# EAGLE design ay-stereo (EAGLE 7.6.0)
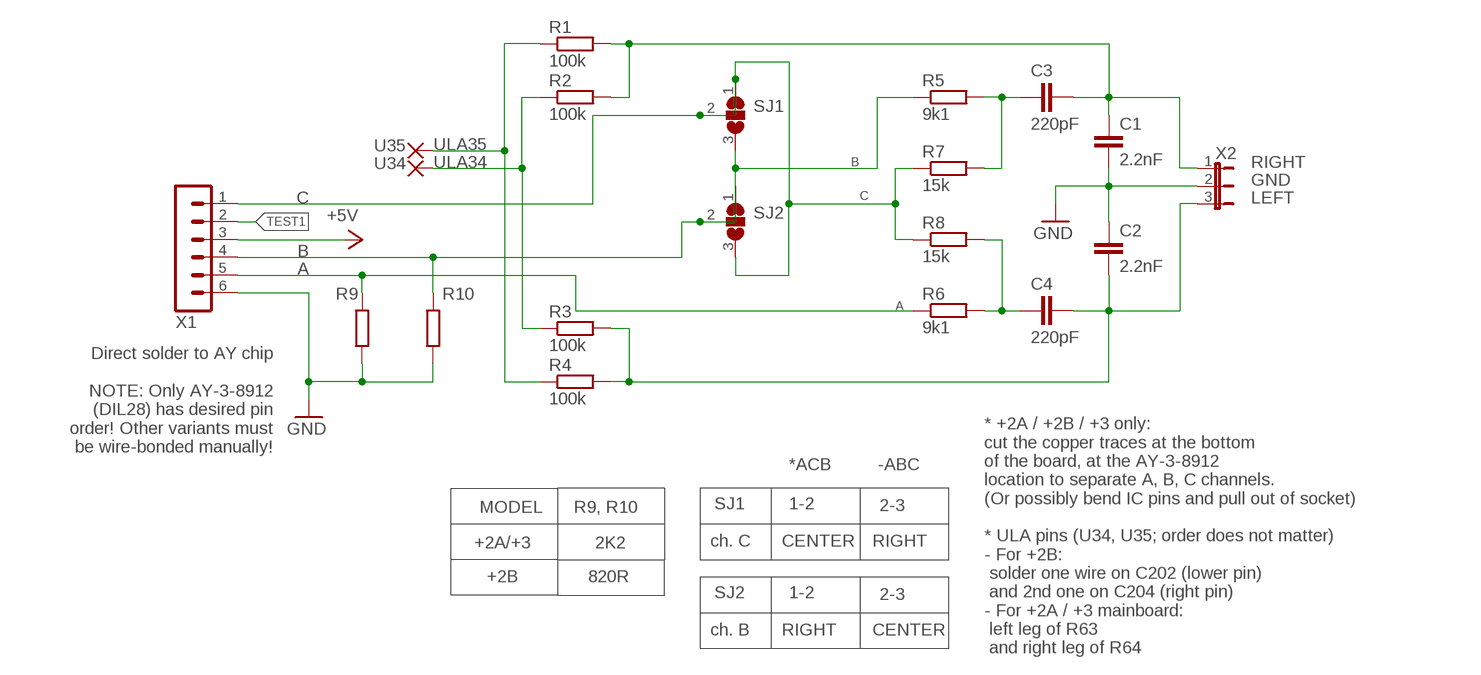
[diagram p0: schematic, sheet 1]

## Parts
C1  2.2nF  C-EUC0805  [C0805]
C2  2.2nF  C-EUC0805  [C0805]
C3  220pF  C-EUC0805  [C0805]
C4  220pF  C-EUC0805  [C0805]
R1  100k  R-EU_R0805  [R0805]
R2  100k  R-EU_R0805  [R0805]
R3  100k  R-EU_R0805  [R0805]
R4  100k  R-EU_R0805  [R0805]
R5  9k1  R-EU_R0805  [R0805]
R6  9k1  R-EU_R0805  [R0805]
R7  15k  R-EU_R0805  [R0805]
R8  15k  R-EU_R0805  [R0805]
R9  R-EU_R0805  [R0805]
R10  R-EU_R0805  [R0805]
SJ1  SJ2W  [SJ_2]
SJ2  SJ2W  [SJ_2]
U34  1,6/0,8  [1,6/0,8]
U35  1,6/0,8  [1,6/0,8]
X1  MA06-1  [MA06-1]
X2  JP2E  [JP2]

## Nets
+5V: X1.3
A: R6.1 R9.2 X1.5
B: R5.1 R10.2 SJ1.3 SJ2.1 SJ2.2 X1.4
C: R7.1 R8.1 SJ1.1 SJ1.2 SJ2.3 X1.1
GND: C1.2 C2.1 R9.1 R10.1 X1.6 X2.2
LEFT: C2.2 C4.2 R3.2 R4.2 X2.3
N$1: C3.1 R5.2 R7.2
N$3: C4.1 R6.2 R8.2
RIGHT: C1.1 C3.2 R1.2 R2.2 X2.1
TEST1: X1.2
ULA34: R2.1 R3.1 U34.1(P)
ULA35: R1.1 R4.1 U35.1(P)

## Notes on the sheet
- * +2A / +2B / +3 only:
  cut the copper traces at the bottom
  of the board, at the AY-3-8912
  location to separate A, B, C channels.
  (Or possibly bend IC pins and pull out of socket)
  
  * ULA pins (U34, U35; order does not matter)
  - For +2B:
   solder one wire on C202 (lower pin)
   and 2nd one on C204 (right pin)
  - For +2A / +3 mainboard:
   left leg of R63
   and right leg of R64
- Direct solder to AY chip
  
  NOTE: Only AY-3-8912
  (DIL28) has desired pin
  order! Other variants must
  be wire-bonded manually!
- *ACB | -ABC
- MODEL | R9, R10 | SJ1 | 1-2 | 2-3
- +2A/+3 | 2K2 | ch. C | CENTER | RIGHT
- +2B | 820R
- SJ2 | 1-2 | 2-3
- ch. B | RIGHT | CENTER

## Library data of the parts
C1-C4 = resistor:C-EU: CAPACITOR, European symbol
R1-R10 = rcl:R-EU_: RESISTOR, European symbol
SJ1 SJ2 = jumper:SJ2W: SMD solder JUMPER
U34 U35 = wirepad:1,6/0,8: THROUGH-HOLE PAD
X1 = con-lstb:MA06-1: PIN HEADER; OC_FARNELL: unknown; OC_NEWARK: unknown
X2 = jumper:JP2E: JUMPER

## Board
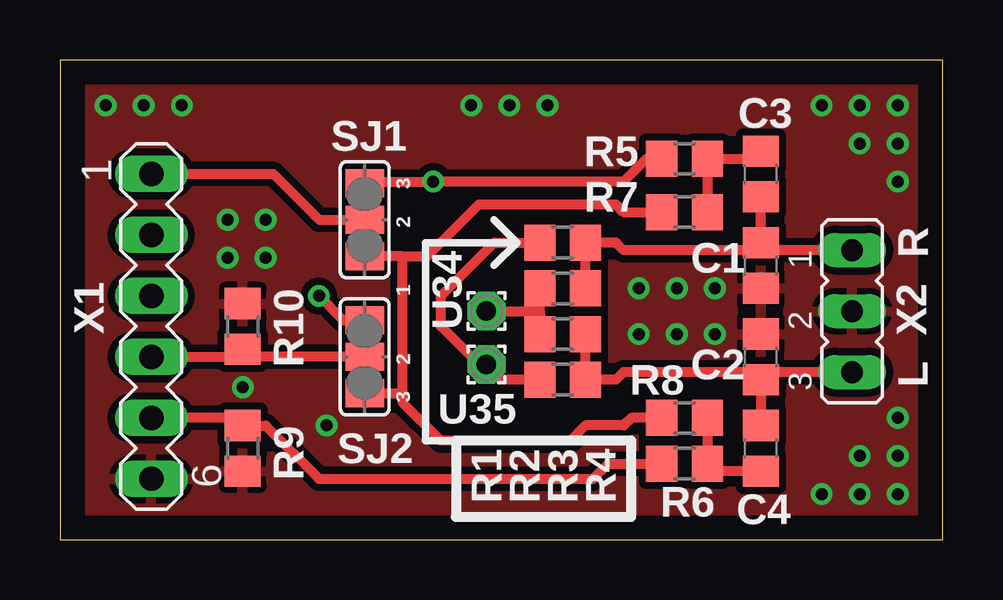
[diagram p1: board, top side]
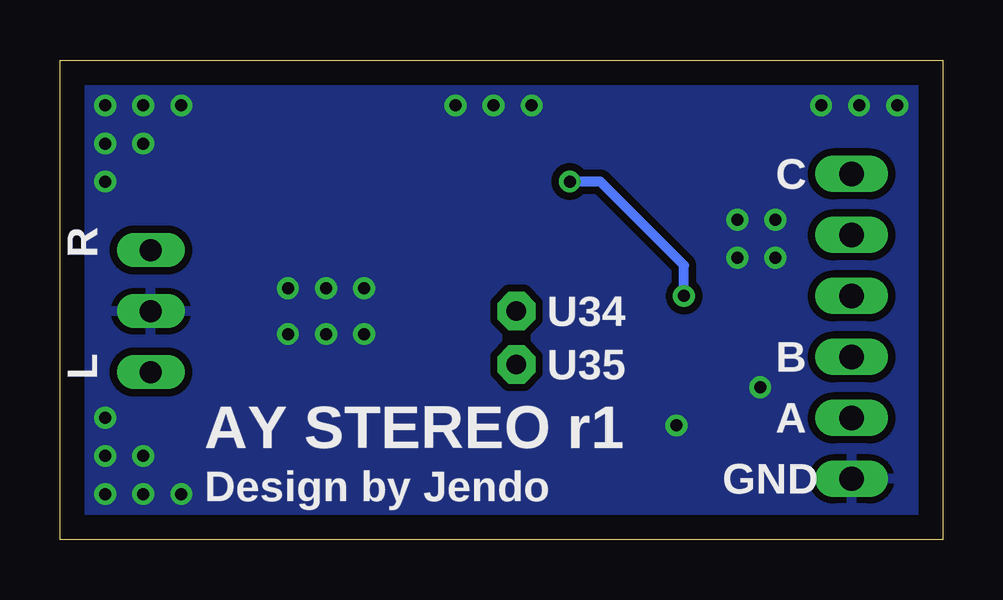
[diagram p2: board, bottom side, seen from below]

Size 36.81 x 19.99 mm. Coordinates in mm from the lower left corner, seen from the top.
Outline: 0,0 36.81,0 36.81,19.99 0,19.99 0,0
Copper layers (1*16): Top 0.035mm / dielectric 1.5mm / Bottom 0.035mm
Design rules "default *": minimum track width 10mil, minimum drill 24mil, track to track 8mil, track to pad 8mil, pad to pad 8mil, via to via 8mil, smd to smd 8mil, copper to edge 40mil, drill to drill 8mil, minimum pad ring 10mil, minimum via ring 8mil, stop-mask expansion 4mil, vias tented up to drill 40mil, thermal gap 10mil

### Footprints (pad centres in the part's own frame; a part is rotated, then mirrored left to right if it is on the bottom)
C0805 = smd 1.3 x 1.5: 1 -0.95,0; 2 0.95,0
R0805 = smd 1.3 x 1.5: 1 -0.95,0; 2 0.95,0
SJ_2 = smd 1.168 x 1.6: 1 -1.524,0; 2 0,0; 3 1.524,0
1,6/0,8 = drill 0.813 pad 1.6 octagon: 1 0,0
MA06-1 = drill 1.016 long: 1 -6.35,0; 2 -3.81,0; 3 -1.27,0; 4 1.27,0; 5 3.81,0; 6 6.35,0
JP2 = drill 0.914 long: 1 -2.54,0; 2 0,0; 3 2.54,0

### Placement (x,y rotation side)
C1  29.21,11.43 270 top
C2  29.21,7.62 270 top
C3  29.21,15.24 270 top
C4  29.21,3.81 90 top
R1  20.96,12.38 0 top
R2  20.96,10.48 0 top
R3  20.96,8.57 0 top
R4  20.96,6.67 0 top
R5  26.04,15.88 0 top
R6  26.04,3.17 0 top
R7  26.04,13.65 0 top
R8  26.04,5.08 0 top
R9  7.62,3.81 90 top
R10  7.62,8.89 270 top
SJ1  12.7,13.34 90 top
SJ2  12.7,7.62 270 top
U34  17.78,9.53 0 top
U35  17.78,7.3 0 top
X1  3.81,8.89 270 top
X2  33.02,9.53 270 top

### Tracks (layer width: path | path; a pad name or v marks a point on that pad's centre or on a via)
A
  Top 0.406: X1.5 7.3,5.08 R9.2 8.58,4.76 10.79,2.54 22.23,2.54 22.86,3.17 R6.1
B  (via drill 0.5)
  Top 0.406: X1.4 7.3,7.62 R10.2 7.62,7.62 SJ2.2 SJ2.1 11.81,9.14 v10.79,10.16 | R5.1 24.45,15.88 23.5,14.92 v15.56,14.92 12.76,14.92 SJ1.3
  Bottom 0.406: v10.79,10.16 10.79,11.43 14.29,14.92 v15.56,14.92
C
  Top 0.406: R8.1 23.81,5.08 23.5,4.76 21.91,4.76 21.27,4.13 15.88,4.13 14.29,5.71 14.29,6.03 | 14.29,6.03 14.29,11.81 | R7.1 23.5,13.65 23.18,13.97 17.46,13.97 15.3,11.81 14.29,11.81 | 14.29,11.81 SJ1.1 SJ1.2 10.79,13.34 8.89,15.24 X1.1 | SJ2.3 14.22,6.1 14.29,6.03
GND  (via drill 0.5)
  other vias: 24.13,10.48 25.72,10.48 27.31,10.48 27.31,8.57 25.72,8.57 24.13,8.57 34.92,1.91 33.34,1.91 31.75,1.91 34.92,18.1 33.34,3.49 34.92,3.49 33.34,18.1 34.92,16.51 34.92,5.08 34.92,14.92 31.75,18.1 33.34,16.51 1.91,18.1 3.49,18.1 5.08,18.1 17.15,18.1 18.73,18.1 20.32,18.1 6.98,11.75 8.57,11.75 6.98,13.34 8.57,13.34 7.62,6.35 11.11,4.76
  pour Top (isolate 0.305): -0.64,21.59 -0.64,-1.27 41.27,-1.27 41.27,21.59
  pour Bottom (isolate 0.305): -3.17,22.86 38.73,22.86 38.73,-2.54 -3.17,-2.54
LEFT
  Top 0.406: X2.3 29.53,6.99 C2.2 | C2.2 C4.2 | C2.2 28.9,6.99 23.5,6.99 23.18,6.67 R4.2 R3.2
N$1
  Top 0.406: C3.1 28.9,15.88 R5.2 R7.2
N$3
  Top 0.406: R8.2 R6.2 27.3,2.86 C4.1
RIGHT
  Top 0.406: X2.1 29.53,12.06 C1.1 | C1.1 C3.2 | R2.2 R1.2 23.18,12.38 23.5,12.06 28.9,12.06 C1.1
ULA34
  Top 0.406: R3.1 20.01,9.21 20.01,9.53 | 20.01,9.53 R2.1 | U34.1 20.01,9.53
ULA35
  Top 0.406: R4.1 18.42,6.67 U35.1 17.46,7.3 15.88,8.89 15.88,10.16 18.1,12.38 R1.1

### Text on the board
tNames: 3 | 2 | R | 1 | 2 | 3 | L
bNames: C | R | U34 | B | U35 | L | A | AY STEREO r1 | GND | Design by Jendo